# Altium project Ultrascale.PrjPcb (part 9 of 9)
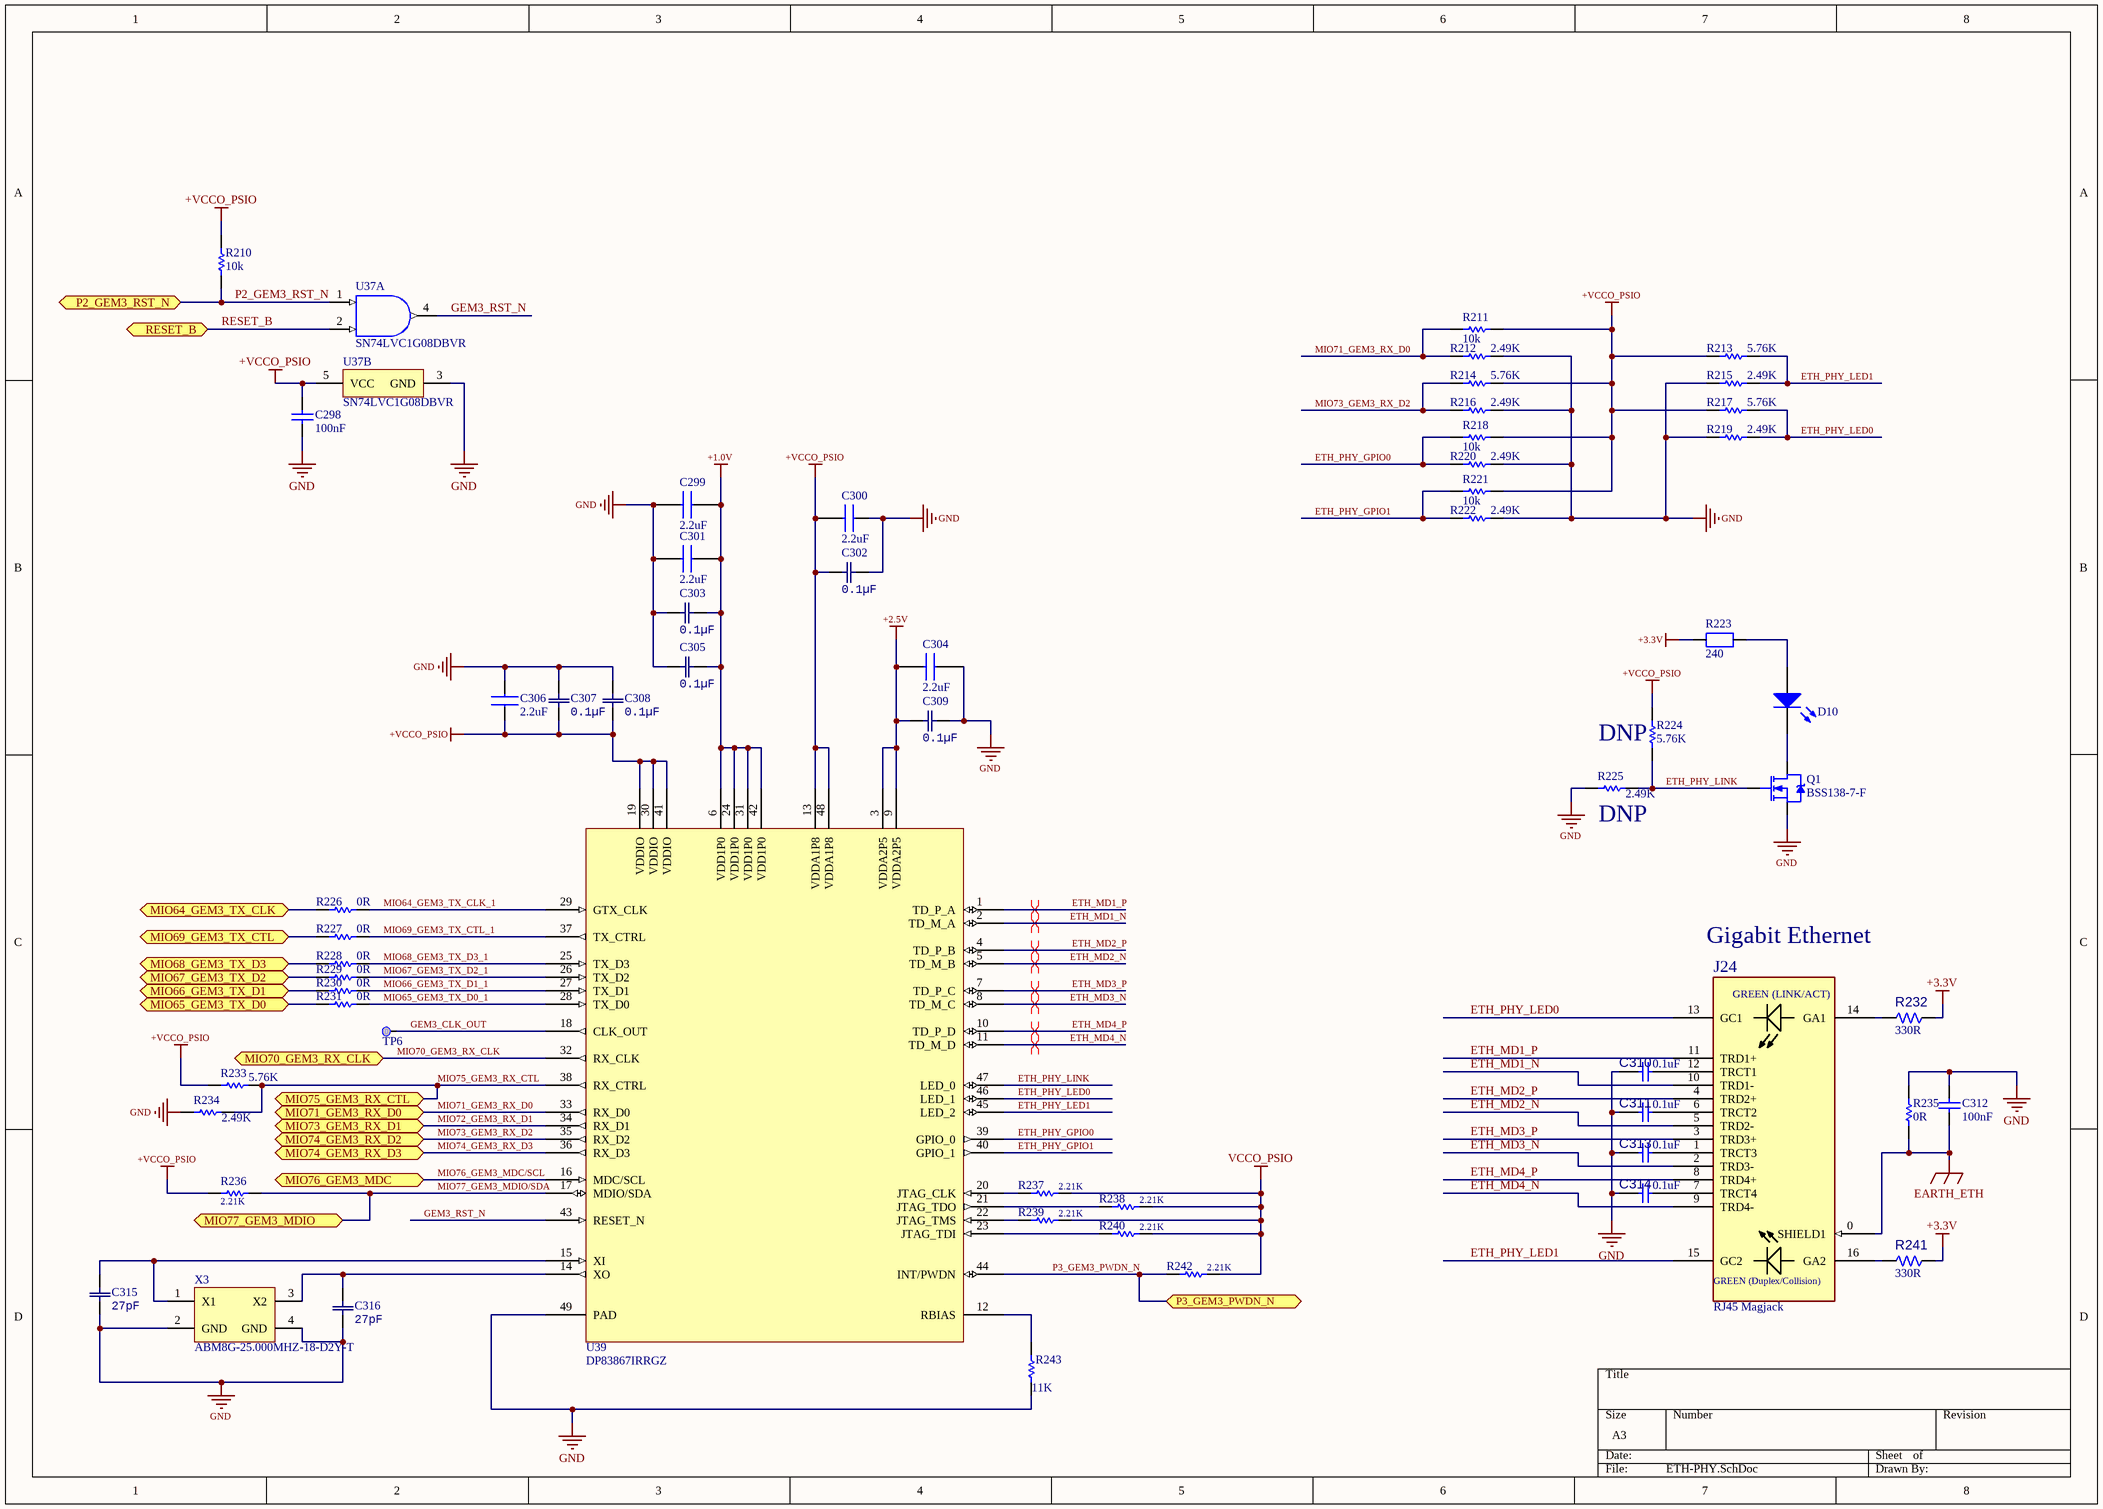
[diagram p24: ETH-PHY.SchDoc]

## Nets that join several sheets
2V5_ETH: Power3 (C414.2 R295.2 U48.9 U48.10), Eth_Switch (FB18.1 FB19.1 R170.2)
+3.3V: Power1 (16 pins), Power2 (16 pins), Power3 (35 pins), Power4 (8 pins), DDR4_SODIMM_PWR (20 pins), Zynq_Power (16 pins), QSPI_EMMC_MICROSD (8 pins), JTAG (9 pins), SYSMON (C96.1 U10.1), DisplayPort (12 pins), USB3.0_UART (16 pins), PMOD_ARD_RASP (16 pins), eMMC_TPM (30 pins), Eth_Switch (24 pins), Eth_Switch_RJ45 (10 pins), WIFI_BT (C280.1 C281.1 J21.1), ETH-PHY (R223.1 R232.2 R241.2)
+5.0V: Power3 (C396.1 C398.2 FB34.2 FB35.2), DisplayPort (C285.2 U35.1 U35.3), USB3.0_UART (C122.2 U21.7)
+MGTRAVCC: Power4 (C421.2 FB39.2 FB40.2 FB41.2), Zynq_Power (6 pins)
+MGTRAVTT: Power3 (C393.2 R281.2 U45.9 U45.10), Zynq_Power (C75.1 C76.2 FB2.1)
+VCC_PSINTFP: Power2 (6 pins), Zynq_Power (33 pins)
+VCC_PSPLL: Power3 (C407.2 R288.2 U47.9 U47.10), Zynq_Power (5 pins)
+VCCAUX: Power3 (5 pins), Zynq_Power (32 pins), QSPI_EMMC_MICROSD (40 pins), JTAG (22 pins), SYSMON (FB5.2 R28.1 R33.1 R34.1), PS_GTR (FB42.1), PL_IO (C1.2 R2.2 R3.2 U2.1), USB3.0_UART (11 pins), WIFI_BT (C277.2 FB21.1), ETH-PHY (22 pins)
+VCCINT: Power2 (C363.2 FB28.2 FB29.2 FB30.2), Zynq_Power (28 pins), SYSMON (R30.1)
+VCCO_HP_64: Power1 (C353.2 FB25.2 FB26.2 FB27.2), DDR4_SODIMM_PWR (C188.2 C189.2 R124.2 U28.2), Zynq_Power (15 pins), PL_DDR4_SODIMM (39 pins), PL_DDR4 (R245.2)
DDR4_DIMM_VDDQ: Power1 (C343.2 FB22.2 FB23.2 FB24.2), DDR4_SODIMM_PWR (C174.2 C175.2 R117.2 U26.2), Zynq_Power (13 pins), PS_DDR4_SODIMM (39 pins)
DDR4_VDDSPD_2V5: DDR4_SODIMM_PWR (C182.2 FB15.2), PS_DDR4_SODIMM (C157.2 J14.255 R112.2), PL_DDR4_SODIMM (C326.2 J25.255), PL_IO (5 pins)
EARTH_ETH: Eth_Switch_RJ45 (6 pins), ETH-PHY (C312.2 J24.0 R235.1)
GND: Power1 (36 pins), Power2 (38 pins), Power3 (64 pins), Power4 (18 pins), DDR4_SODIMM_PWR (42 pins), Zynq_Power (209 pins), QSPI_EMMC_MICROSD (50 pins), JTAG (39 pins), SYSMON (10 pins), PS_DDR4_SODIMM (117 pins), PL_DDR4_SODIMM (118 pins), PS_DDR4 (R131.1), PL_DDR4 (C317.1 C318.1 C319.1 R246.2), PS_GTR (15 pins), DisplayPort (31 pins), PL_IO (C1.1 C2.2 C3.1 U2.4), USB3.0_UART (41 pins), PMOD_ARD_RASP (40 pins), eMMC_TPM (83 pins), Eth_Switch (81 pins), Eth_Switch_RJ45 (21 pins), WIFI_BT (76 pins), ETH-PHY (34 pins)
GND_SYSMON: Zynq_Power (U1.W20), SYSMON (10 pins)
PL_DDR4_VPP_2V5: DDR4_SODIMM_PWR (C187.2 R128.2 U29.9 U29.10), PL_DDR4_SODIMM (J25.257 J25.259)
PL_DDR4_VTT: DDR4_SODIMM_PWR (5 pins), PL_DDR4_SODIMM (J25.258), PL_DDR4 (6 pins)
PS_DDR4_VPP_2V5: DDR4_SODIMM_PWR (6 pins), PS_DDR4_SODIMM (J14.257 J14.259)
PS_DDR4_VTT: DDR4_SODIMM_PWR (5 pins), PS_DDR4_SODIMM (J14.258)
PVIN_5V: Power3 (19 pins), PMOD_ARD_RASP (C137.2 FB12.1 FB14.1)
3.3V_PGOOD: Power2 (U42.38), Power3 (R283.1 R297.1 U44.8)
BT_EN_SOC: PL_IO (U1.AB10), WIFI_BT (R184.2 U34.41)
BT_HCI_CTS: PL_IO (U1.Y9), WIFI_BT (U34.51)
BT_HCI_RTS: PL_IO (U1.AA8), WIFI_BT (U34.50)
BT_HCI_RX: PL_IO (U1.W10), WIFI_BT (U34.53)
BT_HCI_TX: PL_IO (U1.Y10), WIFI_BT (U34.52)
CC_SCL: QSPI_EMMC_MICROSD (U14.6), PS_GTR (R309.1)
CC_SDA: QSPI_EMMC_MICROSD (U14.5), PS_GTR (R305.1)
DDR4_SODIMM_A0: PS_DDR4_SODIMM (J14.144), PS_DDR4 (U1.W28)
DDR4_SODIMM_A1: PS_DDR4_SODIMM (J14.133), PS_DDR4 (U1.Y28)
DDR4_SODIMM_A2: PS_DDR4_SODIMM (J14.132), PS_DDR4 (U1.AB28)
DDR4_SODIMM_A3: PS_DDR4_SODIMM (J14.131), PS_DDR4 (U1.AA28)
DDR4_SODIMM_A4: PS_DDR4_SODIMM (J14.128), PS_DDR4 (U1.Y27)
DDR4_SODIMM_A5: PS_DDR4_SODIMM (J14.126), PS_DDR4 (U1.AA27)
DDR4_SODIMM_A6: PS_DDR4_SODIMM (J14.127), PS_DDR4 (U1.Y22)
DDR4_SODIMM_A7: PS_DDR4_SODIMM (J14.122), PS_DDR4 (U1.AA23)
DDR4_SODIMM_A8: PS_DDR4_SODIMM (J14.125), PS_DDR4 (U1.AA22)
DDR4_SODIMM_A9: PS_DDR4_SODIMM (J14.121), PS_DDR4 (U1.AB23)
DDR4_SODIMM_A10: PS_DDR4_SODIMM (J14.146), PS_DDR4 (U1.AA25)
DDR4_SODIMM_A11: PS_DDR4_SODIMM (J14.120), PS_DDR4 (U1.AA26)
DDR4_SODIMM_A12: PS_DDR4_SODIMM (J14.119), PS_DDR4 (U1.AB25)
DDR4_SODIMM_A13: PS_DDR4_SODIMM (J14.158), PS_DDR4 (U1.AB26)
DDR4_SODIMM_ACT_B: PS_DDR4_SODIMM (J14.114), PS_DDR4 (U1.Y23)
DDR4_SODIMM_ALERT_B: PS_DDR4_SODIMM (J14.116), PS_DDR4 (U1.U25)
DDR4_SODIMM_BA0: PS_DDR4_SODIMM (J14.150), PS_DDR4 (U1.V23)
DDR4_SODIMM_BA1: PS_DDR4_SODIMM (J14.145), PS_DDR4 (U1.W22)
DDR4_SODIMM_BG0: PS_DDR4_SODIMM (J14.115), PS_DDR4 (U1.W24)
DDR4_SODIMM_BG1: PS_DDR4_SODIMM (J14.113), PS_DDR4 (U1.V22)
DDR4_SODIMM_CAS_B: PS_DDR4_SODIMM (J14.156), PS_DDR4 (U1.AC24)
DDR4_SODIMM_CB0: PS_DDR4_SODIMM (J14.92), PS_DDR4 (U1.T28)
DDR4_SODIMM_CB1: PS_DDR4_SODIMM (J14.91), PS_DDR4 (U1.R28)
DDR4_SODIMM_CB2: PS_DDR4_SODIMM (J14.101), PS_DDR4 (U1.P28)
DDR4_SODIMM_CB3: PS_DDR4_SODIMM (J14.105), PS_DDR4 (U1.P27)
DDR4_SODIMM_CB4: PS_DDR4_SODIMM (J14.88), PS_DDR4 (U1.P26)
DDR4_SODIMM_CB5: PS_DDR4_SODIMM (J14.87), PS_DDR4 (U1.R25)
DDR4_SODIMM_CB6: PS_DDR4_SODIMM (J14.100), PS_DDR4 (U1.P25)
DDR4_SODIMM_CB7: PS_DDR4_SODIMM (J14.104), PS_DDR4 (U1.T25)
DDR4_SODIMM_CK0_C: PS_DDR4_SODIMM (J14.139), PS_DDR4 (U1.W26)
DDR4_SODIMM_CK0_T: PS_DDR4_SODIMM (J14.137), PS_DDR4 (U1.W25)
DDR4_SODIMM_CK1_C: PS_DDR4_SODIMM (J14.140), PS_DDR4 (U1.Y25)
DDR4_SODIMM_CK1_T: PS_DDR4_SODIMM (J14.138), PS_DDR4 (U1.Y24)
DDR4_SODIMM_CKE0: PS_DDR4_SODIMM (J14.109 R108.1), PS_DDR4 (U1.V28)
DDR4_SODIMM_CKE1: PS_DDR4_SODIMM (J14.110 R109.1), PS_DDR4 (U1.V27)
DDR4_SODIMM_CS0_B: PS_DDR4_SODIMM (J14.149), PS_DDR4 (U1.W27)
DDR4_SODIMM_CS1_B: PS_DDR4_SODIMM (J14.157), PS_DDR4 (U1.V26)
DDR4_SODIMM_DM0_B: PS_DDR4_SODIMM (J14.12), PS_DDR4 (U1.AG20)
DDR4_SODIMM_DM1_B: PS_DDR4_SODIMM (J14.33), PS_DDR4 (U1.AE23)
DDR4_SODIMM_DM2_B: PS_DDR4_SODIMM (J14.54), PS_DDR4 (U1.AE25)
DDR4_SODIMM_DM3_B: PS_DDR4_SODIMM (J14.75), PS_DDR4 (U1.AE28)
DDR4_SODIMM_DM4_B: PS_DDR4_SODIMM (J14.178), PS_DDR4 (U1.R23)
DDR4_SODIMM_DM5_B: PS_DDR4_SODIMM (J14.199), PS_DDR4 (U1.H23)
DDR4_SODIMM_DM6_B: PS_DDR4_SODIMM (J14.220), PS_DDR4 (U1.L27)
DDR4_SODIMM_DM7_B: PS_DDR4_SODIMM (J14.241), PS_DDR4 (U1.H26)
DDR4_SODIMM_DM8_B: PS_DDR4_SODIMM (J14.96), PS_DDR4 (U1.T26)
DDR4_SODIMM_DQ0: PS_DDR4_SODIMM (J14.8), PS_DDR4 (U1.AD21)
DDR4_SODIMM_DQ1: PS_DDR4_SODIMM (J14.7), PS_DDR4 (U1.AE20)
DDR4_SODIMM_DQ2: PS_DDR4_SODIMM (J14.20), PS_DDR4 (U1.AD20)
DDR4_SODIMM_DQ3: PS_DDR4_SODIMM (J14.21), PS_DDR4 (U1.AF20)
DDR4_SODIMM_DQ4: PS_DDR4_SODIMM (J14.4), PS_DDR4 (U1.AH21)
DDR4_SODIMM_DQ5: PS_DDR4_SODIMM (J14.3), PS_DDR4 (U1.AH20)
DDR4_SODIMM_DQ6: PS_DDR4_SODIMM (J14.16), PS_DDR4 (U1.AH19)
DDR4_SODIMM_DQ7: PS_DDR4_SODIMM (J14.17), PS_DDR4 (U1.AG19)
DDR4_SODIMM_DQ8: PS_DDR4_SODIMM (J14.28), PS_DDR4 (U1.AF22)
DDR4_SODIMM_DQ9: PS_DDR4_SODIMM (J14.29), PS_DDR4 (U1.AH22)
DDR4_SODIMM_DQ10: PS_DDR4_SODIMM (J14.41), PS_DDR4 (U1.AE22)
DDR4_SODIMM_DQ11: PS_DDR4_SODIMM (J14.42), PS_DDR4 (U1.AD22)
DDR4_SODIMM_DQ12: PS_DDR4_SODIMM (J14.24), PS_DDR4 (U1.AH23)
DDR4_SODIMM_DQ13: PS_DDR4_SODIMM (J14.25), PS_DDR4 (U1.AH24)
DDR4_SODIMM_DQ14: PS_DDR4_SODIMM (J14.38), PS_DDR4 (U1.AE24)
DDR4_SODIMM_DQ15: PS_DDR4_SODIMM (J14.37), PS_DDR4 (U1.AG24)
DDR4_SODIMM_DQ16: PS_DDR4_SODIMM (J14.50), PS_DDR4 (U1.AC26)
DDR4_SODIMM_DQ17: PS_DDR4_SODIMM (J14.49), PS_DDR4 (U1.AD26)
DDR4_SODIMM_DQ18: PS_DDR4_SODIMM (J14.62), PS_DDR4 (U1.AD25)
DDR4_SODIMM_DQ19: PS_DDR4_SODIMM (J14.63), PS_DDR4 (U1.AD24)
DDR4_SODIMM_DQ20: PS_DDR4_SODIMM (J14.46), PS_DDR4 (U1.AG26)
DDR4_SODIMM_DQ21: PS_DDR4_SODIMM (J14.45), PS_DDR4 (U1.AH25)
DDR4_SODIMM_DQ22: PS_DDR4_SODIMM (J14.58), PS_DDR4 (U1.AH26)
DDR4_SODIMM_DQ23: PS_DDR4_SODIMM (J14.59), PS_DDR4 (U1.AG25)
DDR4_SODIMM_DQ24: PS_DDR4_SODIMM (J14.70), PS_DDR4 (U1.AH27)
DDR4_SODIMM_DQ25: PS_DDR4_SODIMM (J14.71), PS_DDR4 (U1.AH28)
DDR4_SODIMM_DQ26: PS_DDR4_SODIMM (J14.83), PS_DDR4 (U1.AF28)
DDR4_SODIMM_DQ27: PS_DDR4_SODIMM (J14.84), PS_DDR4 (U1.AG28)
DDR4_SODIMM_DQ28: PS_DDR4_SODIMM (J14.66), PS_DDR4 (U1.AC27)
DDR4_SODIMM_DQ29: PS_DDR4_SODIMM (J14.67), PS_DDR4 (U1.AD27)
DDR4_SODIMM_DQ30: PS_DDR4_SODIMM (J14.79), PS_DDR4 (U1.AD28)
DDR4_SODIMM_DQ31: PS_DDR4_SODIMM (J14.80), PS_DDR4 (U1.AC28)
DDR4_SODIMM_DQ32: PS_DDR4_SODIMM (J14.174), PS_DDR4 (U1.T22)
DDR4_SODIMM_DQ33: PS_DDR4_SODIMM (J14.173), PS_DDR4 (U1.R22)
DDR4_SODIMM_DQ34: PS_DDR4_SODIMM (J14.187), PS_DDR4 (U1.P22)
DDR4_SODIMM_DQ35: PS_DDR4_SODIMM (J14.186), PS_DDR4 (U1.N22)
DDR4_SODIMM_DQ36: PS_DDR4_SODIMM (J14.170), PS_DDR4 (U1.T23)
DDR4_SODIMM_DQ37: PS_DDR4_SODIMM (J14.169), PS_DDR4 (U1.P24)
DDR4_SODIMM_DQ38: PS_DDR4_SODIMM (J14.183), PS_DDR4 (U1.R24)
DDR4_SODIMM_DQ39: PS_DDR4_SODIMM (J14.182), PS_DDR4 (U1.N24)
DDR4_SODIMM_DQ40: PS_DDR4_SODIMM (J14.195), PS_DDR4 (U1.H24)
DDR4_SODIMM_DQ41: PS_DDR4_SODIMM (J14.194), PS_DDR4 (U1.J24)
DDR4_SODIMM_DQ42: PS_DDR4_SODIMM (J14.207), PS_DDR4 (U1.M24)
DDR4_SODIMM_DQ43: PS_DDR4_SODIMM (J14.208), PS_DDR4 (U1.K24)
DDR4_SODIMM_DQ44: PS_DDR4_SODIMM (J14.191), PS_DDR4 (U1.J22)
DDR4_SODIMM_DQ45: PS_DDR4_SODIMM (J14.190), PS_DDR4 (U1.H22)
DDR4_SODIMM_DQ46: PS_DDR4_SODIMM (J14.203), PS_DDR4 (U1.K22)
DDR4_SODIMM_DQ47: PS_DDR4_SODIMM (J14.204), PS_DDR4 (U1.L22)
DDR4_SODIMM_DQ48: PS_DDR4_SODIMM (J14.216), PS_DDR4 (U1.M25)
DDR4_SODIMM_DQ49: PS_DDR4_SODIMM (J14.215), PS_DDR4 (U1.M26)
DDR4_SODIMM_DQ50: PS_DDR4_SODIMM (J14.228), PS_DDR4 (U1.L25)
DDR4_SODIMM_DQ51: PS_DDR4_SODIMM (J14.229), PS_DDR4 (U1.L26)
DDR4_SODIMM_DQ52: PS_DDR4_SODIMM (J14.211), PS_DDR4 (U1.K28)
DDR4_SODIMM_DQ53: PS_DDR4_SODIMM (J14.212), PS_DDR4 (U1.L28)
DDR4_SODIMM_DQ54: PS_DDR4_SODIMM (J14.224), PS_DDR4 (U1.M28)
DDR4_SODIMM_DQ55: PS_DDR4_SODIMM (J14.225), PS_DDR4 (U1.N28)
DDR4_SODIMM_DQ56: PS_DDR4_SODIMM (J14.237), PS_DDR4 (U1.J28)
DDR4_SODIMM_DQ57: PS_DDR4_SODIMM (J14.236), PS_DDR4 (U1.K27)
DDR4_SODIMM_DQ58: PS_DDR4_SODIMM (J14.249), PS_DDR4 (U1.H28)
DDR4_SODIMM_DQ59: PS_DDR4_SODIMM (J14.250), PS_DDR4 (U1.H27)
DDR4_SODIMM_DQ60: PS_DDR4_SODIMM (J14.232), PS_DDR4 (U1.G26)
DDR4_SODIMM_DQ61: PS_DDR4_SODIMM (J14.233), PS_DDR4 (U1.G25)
DDR4_SODIMM_DQ62: PS_DDR4_SODIMM (J14.245), PS_DDR4 (U1.K25)
DDR4_SODIMM_DQ63: PS_DDR4_SODIMM (J14.246), PS_DDR4 (U1.J25)
DDR4_SODIMM_DQS0_C: PS_DDR4_SODIMM (J14.11), PS_DDR4 (U1.AG21)
DDR4_SODIMM_DQS0_T: PS_DDR4_SODIMM (J14.13), PS_DDR4 (U1.AF21)
DDR4_SODIMM_DQS1_C: PS_DDR4_SODIMM (J14.32), PS_DDR4 (U1.AG23)
DDR4_SODIMM_DQS1_T: PS_DDR4_SODIMM (J14.34), PS_DDR4 (U1.AF23)
DDR4_SODIMM_DQS2_C: PS_DDR4_SODIMM (J14.53), PS_DDR4 (U1.AF26)
DDR4_SODIMM_DQS2_T: PS_DDR4_SODIMM (J14.55), PS_DDR4 (U1.AF25)
DDR4_SODIMM_DQS3_C: PS_DDR4_SODIMM (J14.74), PS_DDR4 (U1.AF27)
DDR4_SODIMM_DQS3_T: PS_DDR4_SODIMM (J14.76), PS_DDR4 (U1.AE27)
DDR4_SODIMM_DQS4_C: PS_DDR4_SODIMM (J14.177), PS_DDR4 (U1.M23)
DDR4_SODIMM_DQS4_T: PS_DDR4_SODIMM (J14.179), PS_DDR4 (U1.N23)
DDR4_SODIMM_DQS5_C: PS_DDR4_SODIMM (J14.198), PS_DDR4 (U1.K23)
DDR4_SODIMM_DQS5_T: PS_DDR4_SODIMM (J14.200), PS_DDR4 (U1.L23)
DDR4_SODIMM_DQS6_C: PS_DDR4_SODIMM (J14.219), PS_DDR4 (U1.N27)
DDR4_SODIMM_DQS6_T: PS_DDR4_SODIMM (J14.221), PS_DDR4 (U1.N26)
DDR4_SODIMM_DQS7_C: PS_DDR4_SODIMM (J14.240), PS_DDR4 (U1.J27)
DDR4_SODIMM_DQS7_T: PS_DDR4_SODIMM (J14.242), PS_DDR4 (U1.J26)
DDR4_SODIMM_DQS8_C: PS_DDR4_SODIMM (J14.95), PS_DDR4 (U1.T27)
DDR4_SODIMM_DQS8_T: PS_DDR4_SODIMM (J14.97), PS_DDR4 (U1.R27)
DDR4_SODIMM_ODT0: PS_DDR4_SODIMM (J14.155), PS_DDR4 (U1.U28)
DDR4_SODIMM_ODT1: PS_DDR4_SODIMM (J14.161), PS_DDR4 (U1.U26)
DDR4_SODIMM_PARITY: PS_DDR4_SODIMM (J14.143), PS_DDR4 (U1.V24)
DDR4_SODIMM_PL_A0: PL_DDR4_SODIMM (J25.144), PL_DDR4 (U1.AB8)
DDR4_SODIMM_PL_A1: PL_DDR4_SODIMM (J25.133), PL_DDR4 (U1.AC8)
DDR4_SODIMM_PL_A2: PL_DDR4_SODIMM (J25.132), PL_DDR4 (U1.AD7)
DDR4_SODIMM_PL_A3: PL_DDR4_SODIMM (J25.131), PL_DDR4 (U1.AE7)
DDR4_SODIMM_PL_A4: PL_DDR4_SODIMM (J25.128), PL_DDR4 (U1.AB7)
DDR4_SODIMM_PL_A5: PL_DDR4_SODIMM (J25.126), PL_DDR4 (U1.AC7)
DDR4_SODIMM_PL_A6: PL_DDR4_SODIMM (J25.127), PL_DDR4 (U1.AB6)
DDR4_SODIMM_PL_A7: PL_DDR4_SODIMM (J25.122), PL_DDR4 (U1.AC6)
DDR4_SODIMM_PL_A8: PL_DDR4_SODIMM (J25.125), PL_DDR4 (U1.AG9)
DDR4_SODIMM_PL_A9: PL_DDR4_SODIMM (J25.121), PL_DDR4 (U1.AH9)
DDR4_SODIMM_PL_A10: PL_DDR4_SODIMM (J25.146), PL_DDR4 (U1.AF8)
DDR4_SODIMM_PL_A11: PL_DDR4_SODIMM (J25.120), PL_DDR4 (U1.AG8)
DDR4_SODIMM_PL_A12: PL_DDR4_SODIMM (J25.119), PL_DDR4 (U1.AH8)
DDR4_SODIMM_PL_A13: PL_DDR4_SODIMM (J25.158), PL_DDR4 (U1.AH7)
DDR4_SODIMM_PL_ACT_B: PL_DDR4_SODIMM (J25.114), PL_DDR4 (U1.AB2)
DDR4_SODIMM_PL_ALERT_B: PL_DDR4_SODIMM (J25.116), PL_DDR4 (R244.2 R245.1)
DDR4_SODIMM_PL_BA0: PL_DDR4_SODIMM (J25.150), PL_DDR4 (U1.AF5)
DDR4_SODIMM_PL_BA1: PL_DDR4_SODIMM (J25.145), PL_DDR4 (U1.AH6)
DDR4_SODIMM_PL_BG0: PL_DDR4_SODIMM (J25.115), PL_DDR4 (U1.AD5)
DDR4_SODIMM_PL_BG1: PL_DDR4_SODIMM (J25.113), PL_DDR4 (U1.AD4)
DDR4_SODIMM_PL_CAS_B: PL_DDR4_SODIMM (J25.156), PL_DDR4 (U1.AG5)
DDR4_SODIMM_PL_CB0: PL_DDR4_SODIMM (J25.92), PL_DDR4 (U1.C6)
DDR4_SODIMM_PL_CB1: PL_DDR4_SODIMM (J25.91), PL_DDR4 (U1.B6)
DDR4_SODIMM_PL_CB2: PL_DDR4_SODIMM (J25.101), PL_DDR4 (U1.A7)
DDR4_SODIMM_PL_CB3: PL_DDR4_SODIMM (J25.105), PL_DDR4 (U1.A6)
DDR4_SODIMM_PL_CB4: PL_DDR4_SODIMM (J25.88), PL_DDR4 (U1.A9)
DDR4_SODIMM_PL_CB5: PL_DDR4_SODIMM (J25.87), PL_DDR4 (U1.A8)
DDR4_SODIMM_PL_CB6: PL_DDR4_SODIMM (J25.100), PL_DDR4 (U1.C9)
DDR4_SODIMM_PL_CB7: PL_DDR4_SODIMM (J25.104), PL_DDR4 (U1.B9)
DDR4_SODIMM_PL_CK0_C: PL_DDR4_SODIMM (J25.139), PL_DDR4 (U1.AD9)
DDR4_SODIMM_PL_CK0_T: PL_DDR4_SODIMM (J25.137), PL_DDR4 (U1.AC9)
DDR4_SODIMM_PL_CK1_C: PL_DDR4_SODIMM (J25.140), PL_DDR4 (U1.AE8)
DDR4_SODIMM_PL_CK1_T: PL_DDR4_SODIMM (J25.138), PL_DDR4 (U1.AE9)
DDR4_SODIMM_PL_CKE0: PL_DDR4_SODIMM (J25.109 R248.1), PL_DDR4 (U1.AB4)
DDR4_SODIMM_PL_CKE1: PL_DDR4_SODIMM (J25.110 R249.1), PL_DDR4 (U1.AB3)
DDR4_SODIMM_PL_CS0_B: PL_DDR4_SODIMM (J25.149), PL_DDR4 (U1.AC4)
DDR4_SODIMM_PL_CS1_B: PL_DDR4_SODIMM (J25.157), PL_DDR4 (U1.AC3)
DDR4_SODIMM_PL_DM0_B: PL_DDR4_SODIMM (J25.12), PL_DDR4 (U1.AG4)
DDR4_SODIMM_PL_DM1_B: PL_DDR4_SODIMM (J25.33), PL_DDR4 (U1.W8)
DDR4_SODIMM_PL_DM2_B: PL_DDR4_SODIMM (J25.54), PL_DDR4 (U1.L1)
DDR4_SODIMM_PL_DM3_B: PL_DDR4_SODIMM (J25.75), PL_DDR4 (U1.L7)
DDR4_SODIMM_PL_DM4_B: PL_DDR4_SODIMM (J25.178), PL_DDR4 (U1.J5)
DDR4_SODIMM_PL_DM5_B: PL_DDR4_SODIMM (J25.199), PL_DDR4 (U1.G1)
DDR4_SODIMM_PL_DM6_B: PL_DDR4_SODIMM (J25.220), PL_DDR4 (U1.C1)
DDR4_SODIMM_PL_DM7_B: PL_DDR4_SODIMM (J25.241), PL_DDR4 (U1.D7)
DDR4_SODIMM_PL_DM8_B: PL_DDR4_SODIMM (J25.96), PL_DDR4 (U1.B5)
DDR4_SODIMM_PL_DQ0: PL_DDR4_SODIMM (J25.8), PL_DDR4 (U1.AG3)
DDR4_SODIMM_PL_DQ1: PL_DDR4_SODIMM (J25.7), PL_DDR4 (U1.AH3)
DDR4_SODIMM_PL_DQ2: PL_DDR4_SODIMM (J25.20), PL_DDR4 (U1.AE3)
DDR4_SODIMM_PL_DQ3: PL_DDR4_SODIMM (J25.21), PL_DDR4 (U1.AF3)
DDR4_SODIMM_PL_DQ4: PL_DDR4_SODIMM (J25.4), PL_DDR4 (U1.AH2)
DDR4_SODIMM_PL_DQ5: PL_DDR4_SODIMM (J25.3), PL_DDR4 (U1.AH1)
DDR4_SODIMM_PL_DQ6: PL_DDR4_SODIMM (J25.16), PL_DDR4 (U1.AF1)
DDR4_SODIMM_PL_DQ7: PL_DDR4_SODIMM (J25.17), PL_DDR4 (U1.AG1)
DDR4_SODIMM_PL_DQ8: PL_DDR4_SODIMM (J25.28), PL_DDR4 (U1.U9)
DDR4_SODIMM_PL_DQ9: PL_DDR4_SODIMM (J25.29), PL_DDR4 (U1.V9)
DDR4_SODIMM_PL_DQ10: PL_DDR4_SODIMM (J25.41), PL_DDR4 (U1.U8)
DDR4_SODIMM_PL_DQ11: PL_DDR4_SODIMM (J25.42), PL_DDR4 (U1.V8)
DDR4_SODIMM_PL_DQ12: PL_DDR4_SODIMM (J25.24), PL_DDR4 (U1.R7)
DDR4_SODIMM_PL_DQ13: PL_DDR4_SODIMM (J25.25), PL_DDR4 (U1.T7)
DDR4_SODIMM_PL_DQ14: PL_DDR4_SODIMM (J25.38), PL_DDR4 (U1.R6)
DDR4_SODIMM_PL_DQ15: PL_DDR4_SODIMM (J25.37), PL_DDR4 (U1.T6)
DDR4_SODIMM_PL_DQ16: PL_DDR4_SODIMM (J25.50), PL_DDR4 (U1.J1)
DDR4_SODIMM_PL_DQ17: PL_DDR4_SODIMM (J25.49), PL_DDR4 (U1.H1)
DDR4_SODIMM_PL_DQ18: PL_DDR4_SODIMM (J25.62), PL_DDR4 (U1.K2)
DDR4_SODIMM_PL_DQ19: PL_DDR4_SODIMM (J25.63), PL_DDR4 (U1.J2)
DDR4_SODIMM_PL_DQ20: PL_DDR4_SODIMM (J25.46), PL_DDR4 (U1.K4)
DDR4_SODIMM_PL_DQ21: PL_DDR4_SODIMM (J25.45), PL_DDR4 (U1.K3)
DDR4_SODIMM_PL_DQ22: PL_DDR4_SODIMM (J25.58), PL_DDR4 (U1.L3)
DDR4_SODIMM_PL_DQ23: PL_DDR4_SODIMM (J25.59), PL_DDR4 (U1.L2)
DDR4_SODIMM_PL_DQ24: PL_DDR4_SODIMM (J25.70), PL_DDR4 (U1.M6)
DDR4_SODIMM_PL_DQ25: PL_DDR4_SODIMM (J25.71), PL_DDR4 (U1.L5)
DDR4_SODIMM_PL_DQ26: PL_DDR4_SODIMM (J25.83), PL_DDR4 (U1.N7)
DDR4_SODIMM_PL_DQ27: PL_DDR4_SODIMM (J25.84), PL_DDR4 (U1.N6)
DDR4_SODIMM_PL_DQ28: PL_DDR4_SODIMM (J25.66), PL_DDR4 (U1.N9)
DDR4_SODIMM_PL_DQ29: PL_DDR4_SODIMM (J25.67), PL_DDR4 (U1.N8)
DDR4_SODIMM_PL_DQ30: PL_DDR4_SODIMM (J25.79), PL_DDR4 (U1.M8)
DDR4_SODIMM_PL_DQ31: PL_DDR4_SODIMM (J25.80), PL_DDR4 (U1.L8)
DDR4_SODIMM_PL_DQ32: PL_DDR4_SODIMM (J25.174), PL_DDR4 (U1.J6)
DDR4_SODIMM_PL_DQ33: PL_DDR4_SODIMM (J25.173), PL_DDR4 (U1.H6)
DDR4_SODIMM_PL_DQ34: PL_DDR4_SODIMM (J25.187), PL_DDR4 (U1.J7)
DDR4_SODIMM_PL_DQ35: PL_DDR4_SODIMM (J25.186), PL_DDR4 (U1.H7)
DDR4_SODIMM_PL_DQ36: PL_DDR4_SODIMM (J25.170), PL_DDR4 (U1.K9)
DDR4_SODIMM_PL_DQ37: PL_DDR4_SODIMM (J25.169), PL_DDR4 (U1.J9)
DDR4_SODIMM_PL_DQ38: PL_DDR4_SODIMM (J25.183), PL_DDR4 (U1.H9)
DDR4_SODIMM_PL_DQ39: PL_DDR4_SODIMM (J25.182), PL_DDR4 (U1.H8)
DDR4_SODIMM_PL_DQ40: PL_DDR4_SODIMM (J25.195), PL_DDR4 (U1.E1)
DDR4_SODIMM_PL_DQ41: PL_DDR4_SODIMM (J25.194), PL_DDR4 (U1.D1)
DDR4_SODIMM_PL_DQ42: PL_DDR4_SODIMM (J25.207), PL_DDR4 (U1.F2)
DDR4_SODIMM_PL_DQ43: PL_DDR4_SODIMM (J25.208), PL_DDR4 (U1.E2)
DDR4_SODIMM_PL_DQ44: PL_DDR4_SODIMM (J25.191), PL_DDR4 (U1.E4)
DDR4_SODIMM_PL_DQ45: PL_DDR4_SODIMM (J25.190), PL_DDR4 (U1.E3)
DDR4_SODIMM_PL_DQ46: PL_DDR4_SODIMM (J25.203), PL_DDR4 (U1.G5)
DDR4_SODIMM_PL_DQ47: PL_DDR4_SODIMM (J25.204), PL_DDR4 (U1.F5)
DDR4_SODIMM_PL_DQ48: PL_DDR4_SODIMM (J25.216), PL_DDR4 (U1.A2)
DDR4_SODIMM_PL_DQ49: PL_DDR4_SODIMM (J25.215), PL_DDR4 (U1.A1)
DDR4_SODIMM_PL_DQ50: PL_DDR4_SODIMM (J25.228), PL_DDR4 (U1.B3)
DDR4_SODIMM_PL_DQ51: PL_DDR4_SODIMM (J25.229), PL_DDR4 (U1.A3)
DDR4_SODIMM_PL_DQ52: PL_DDR4_SODIMM (J25.211), PL_DDR4 (U1.D4)
DDR4_SODIMM_PL_DQ53: PL_DDR4_SODIMM (J25.212), PL_DDR4 (U1.C4)
DDR4_SODIMM_PL_DQ54: PL_DDR4_SODIMM (J25.224), PL_DDR4 (U1.C3)
DDR4_SODIMM_PL_DQ55: PL_DDR4_SODIMM (J25.225), PL_DDR4 (U1.C2)
DDR4_SODIMM_PL_DQ56: PL_DDR4_SODIMM (J25.237), PL_DDR4 (U1.E5)
DDR4_SODIMM_PL_DQ57: PL_DDR4_SODIMM (J25.236), PL_DDR4 (U1.D5)
DDR4_SODIMM_PL_DQ58: PL_DDR4_SODIMM (J25.249), PL_DDR4 (U1.G6)
DDR4_SODIMM_PL_DQ59: PL_DDR4_SODIMM (J25.250), PL_DDR4 (U1.F6)
DDR4_SODIMM_PL_DQ60: PL_DDR4_SODIMM (J25.232), PL_DDR4 (U1.F8)
DDR4_SODIMM_PL_DQ61: PL_DDR4_SODIMM (J25.233), PL_DDR4 (U1.E8)
DDR4_SODIMM_PL_DQ62: PL_DDR4_SODIMM (J25.245), PL_DDR4 (U1.E9)
DDR4_SODIMM_PL_DQ63: PL_DDR4_SODIMM (J25.246), PL_DDR4 (U1.D9)
DDR4_SODIMM_PL_DQS0_C: PL_DDR4_SODIMM (J25.11), PL_DDR4 (U1.AF2)
DDR4_SODIMM_PL_DQS0_T: PL_DDR4_SODIMM (J25.13), PL_DDR4 (U1.AE2)
DDR4_SODIMM_PL_DQS1_C: PL_DDR4_SODIMM (J25.32), PL_DDR4 (U1.T8)
DDR4_SODIMM_PL_DQS1_T: PL_DDR4_SODIMM (J25.34), PL_DDR4 (U1.R8)
DDR4_SODIMM_PL_DQS2_C: PL_DDR4_SODIMM (J25.53), PL_DDR4 (U1.H3)
DDR4_SODIMM_PL_DQS2_T: PL_DDR4_SODIMM (J25.55), PL_DDR4 (U1.H4)
DDR4_SODIMM_PL_DQS3_C: PL_DDR4_SODIMM (J25.74), PL_DDR4 (U1.P6)
DDR4_SODIMM_PL_DQS3_T: PL_DDR4_SODIMM (J25.76), PL_DDR4 (U1.P7)
DDR4_SODIMM_PL_DQS4_C: PL_DDR4_SODIMM (J25.177), PL_DDR4 (U1.K7)
DDR4_SODIMM_PL_DQS4_T: PL_DDR4_SODIMM (J25.179), PL_DDR4 (U1.K8)
DDR4_SODIMM_PL_DQS5_C: PL_DDR4_SODIMM (J25.198), PL_DDR4 (U1.F3)
DDR4_SODIMM_PL_DQS5_T: PL_DDR4_SODIMM (J25.200), PL_DDR4 (U1.G3)
DDR4_SODIMM_PL_DQS6_C: PL_DDR4_SODIMM (J25.219), PL_DDR4 (U1.A4)
DDR4_SODIMM_PL_DQS6_T: PL_DDR4_SODIMM (J25.221), PL_DDR4 (U1.B4)
DDR4_SODIMM_PL_DQS7_C: PL_DDR4_SODIMM (J25.240), PL_DDR4 (U1.F7)
DDR4_SODIMM_PL_DQS7_T: PL_DDR4_SODIMM (J25.242), PL_DDR4 (U1.G8)
DDR4_SODIMM_PL_DQS8_C: PL_DDR4_SODIMM (J25.95), PL_DDR4 (U1.B8)
DDR4_SODIMM_PL_DQS8_T: PL_DDR4_SODIMM (J25.97), PL_DDR4 (U1.C8)
DDR4_SODIMM_PL_ODT0: PL_DDR4_SODIMM (J25.155), PL_DDR4 (U1.AD2)
DDR4_SODIMM_PL_ODT1: PL_DDR4_SODIMM (J25.161), PL_DDR4 (U1.AD1)
DDR4_SODIMM_PL_PARITY: PL_DDR4_SODIMM (J25.143), PL_DDR4 (R246.1)
DDR4_SODIMM_PL_RAS_B: PL_DDR4_SODIMM (J25.152), PL_DDR4 (U1.AE5)
DDR4_SODIMM_PL_RESET_B: PL_DDR4_SODIMM (J25.108), PL_DDR4 (U1.AC2)
DDR4_SODIMM_PL_SCL: PS_DDR4_SODIMM (J14.253), PL_DDR4_SODIMM (J25.253), PL_IO (R4.1 U2.7)
DDR4_SODIMM_PL_SDA: PS_DDR4_SODIMM (J14.254), PL_DDR4_SODIMM (J25.254), PL_IO (R5.1 U2.6)
DDR4_SODIMM_PL_WE_B: PL_DDR4_SODIMM (J25.151), PL_DDR4 (U1.AG6)
DDR4_SODIMM_RAS_B: PS_DDR4_SODIMM (J14.152), PS_DDR4 (U1.AC23)
DDR4_SODIMM_RESET_B: PS_DDR4_SODIMM (J14.108), PS_DDR4 (U1.U23)
DDR4_SODIMM_WE_B: PS_DDR4_SODIMM (J14.151), PS_DDR4 (U1.AB24)
DP_HPD: DisplayPort (R197.1), PL_IO (U1.E13)
DP_IN: DisplayPort (R208.1), PL_IO (U1.E14)
DP_OE: DisplayPort (R205.1), PL_IO (U1.F13)
DP_OUT: DisplayPort (R207.1), PL_IO (U1.G13)
ETH_MISO: PL_IO (U1.D14), Eth_Switch (R166.2 U31.97)
ETH_MOSI: PL_IO (U1.D15), Eth_Switch (R165.2 U31.98)
ETH_SCLK: PL_IO (U1.C14), Eth_Switch (U31.101)
ETH_SCS: PL_IO (U1.C13), Eth_Switch (R164.2 U31.100)
ETH_SW_RESETN: PL_IO (U1.A13), Eth_Switch (R160.1 U33.1)
GRXCK: PS_MIO (U1.J16), Eth_Switch (R150.2)
GRXCTL: PS_MIO (U1.J17), Eth_Switch (R151.2)
GRXD0: PS_MIO (U1.L16), Eth_Switch (R155.2 R159.1 R172.1)
GRXD1: PS_MIO (U1.L17), Eth_Switch (R154.2 R158.1)
GRXD2: PS_MIO (U1.H17), Eth_Switch (R153.2 R157.1)
GRXD3: PS_MIO (U1.K17), Eth_Switch (R152.2 R156.1)
GTR_RX0_N: PS_GTR (U1.F28), USB3.0_UART (J4.5 U23.2 U23.9)
GTR_RX0_P: PS_GTR (U1.F27), USB3.0_UART (J4.6 U23.1 U23.10)
GTR_TX0_N: PS_GTR (U1.E26), USB3.0_UART (C129.1)
GTR_TX0_P: PS_GTR (U1.E25), USB3.0_UART (C130.1)
GTR_TX2_N: PS_GTR (U1.C26), DisplayPort (C286.1)
GTR_TX2_P: PS_GTR (U1.C25), DisplayPort (C284.1)
GTR_TX3_N: PS_GTR (U1.B24), DisplayPort (C283.1)
GTR_TX3_P: PS_GTR (U1.B23), DisplayPort (C282.1)
GTXCK: PS_MIO (U1.L15), Eth_Switch (U31.48)
GTXCTL: PS_MIO (U1.H16), Eth_Switch (U31.49)
GTXD0: PS_MIO (U1.J15), Eth_Switch (U31.55)
GTXD1: PS_MIO (U1.K15), Eth_Switch (U31.54)
GTXD2: PS_MIO (U1.G16), Eth_Switch (U31.53)
GTXD3: PS_MIO (U1.F16), Eth_Switch (U31.52)
ID: PL_IO (U1.G15), eMMC_TPM (U30.14)
INTRP_N: PL_IO (U1.A14), Eth_Switch (R163.2 U31.94)
LAD0: PL_IO (U1.H13), eMMC_TPM (U30.11)
LAD1: PL_IO (U1.G14), eMMC_TPM (U30.10)
LAD2: PL_IO (U1.H14), eMMC_TPM (U30.8)
LAD3: PL_IO (U1.K14), eMMC_TPM (U30.7)
LCLK: PL_IO (U1.L13), eMMC_TPM (U30.1)
LED1_0: Eth_Switch (R175.1 U31.105), Eth_Switch_RJ45 (J16.13)
LED1_1: Eth_Switch (R176.1 U31.106), Eth_Switch_RJ45 (J16.15)
LED2_0: Eth_Switch (R173.1 U31.91), Eth_Switch_RJ45 (J17.13)
LED2_1: Eth_Switch (R177.1 U31.92), Eth_Switch_RJ45 (J17.15)
LED3_0: Eth_Switch (U31.88), Eth_Switch_RJ45 (J19.13)
LED3_1: Eth_Switch (U31.89), Eth_Switch_RJ45 (J19.15)
LED4_0: Eth_Switch (R174.1 U31.85), Eth_Switch_RJ45 (J15.13)
LED4_1: Eth_Switch (R178.1 U31.86), Eth_Switch_RJ45 (J15.15)
LED5_0: Eth_Switch (U31.102), Eth_Switch_RJ45 (J18.13)
LED5_1: Eth_Switch (R179.1 U31.103), Eth_Switch_RJ45 (J18.15)
LFRAME: PL_IO (U1.L14), eMMC_TPM (U30.3)
LRESET: PL_IO (U1.J14), eMMC_TPM (U30.5)
MGTRAVCC_GOOD: Power1 (U40.38 U41.38), Power3 (U45.5), Power4 (R303.1 U49.39)
MIO0_QSPI0_SCLK: QSPI_EMMC_MICROSD (U11.6), PS_MIO (U1.AG15)
MIO1_QSPI0_IO1: QSPI_EMMC_MICROSD (U11.2), PS_MIO (U1.AG16)
MIO2_QSPI0_IO2: QSPI_EMMC_MICROSD (R44.2 U11.3), PS_MIO (U1.AF15)
MIO3_QSPI0_IO3: QSPI_EMMC_MICROSD (R45.2 U11.7), PS_MIO (U1.AH15)
MIO4_QSPI0_IO0: QSPI_EMMC_MICROSD (U11.5), PS_MIO (U1.AH16)
MIO5_QSPI0_SS_B: QSPI_EMMC_MICROSD (R43.2 U11.1), PS_MIO (U1.AD16)
MIO7_QSPI1_SS_B: QSPI_EMMC_MICROSD (R46.2 U12.1), PS_MIO (U1.AH17)
MIO8_QSPI1_IO0: QSPI_EMMC_MICROSD (U12.5), PS_MIO (U1.AF17)
MIO9_QSPI1_IO1: QSPI_EMMC_MICROSD (U12.2), PS_MIO (U1.AC16)
MIO10_QSPI1_IO2: QSPI_EMMC_MICROSD (R47.2 U12.3), PS_MIO (U1.AD17)
MIO11_QSPI1_IO3: QSPI_EMMC_MICROSD (R48.2 U12.7), PS_MIO (U1.AE17)
MIO12_QSPI1_SCLK: QSPI_EMMC_MICROSD (U12.6), PS_MIO (U1.AC17)
MIO13_EMMC0_IO0: QSPI_EMMC_MICROSD (R65.1 SD1.6), PS_MIO (U1.AH18)
MIO14_EMMC0_IO1: QSPI_EMMC_MICROSD (R66.1 SD1.29), PS_MIO (U1.AG18)
MIO15_EMMC0_IO2: QSPI_EMMC_MICROSD (R67.1 SD1.27), PS_MIO (U1.AE18)
MIO16_EMMC0_IO3: QSPI_EMMC_MICROSD (R68.1 SD1.10), PS_MIO (U1.AF18)
MIO17_EMMC0_IO4: QSPI_EMMC_MICROSD (R69.1 SD1.4), PS_MIO (U1.AC18)
MIO18_EMMC0_IO5: QSPI_EMMC_MICROSD (R70.1 SD1.2), PS_MIO (U1.AC19)
MIO19_EMMC0_IO6: QSPI_EMMC_MICROSD (R71.1 SD1.33), PS_MIO (U1.AE19)
MIO20_EMMC0_IO7: QSPI_EMMC_MICROSD (R72.1 SD1.31), PS_MIO (U1.AD19)
MIO21_EMMC0_CMD: QSPI_EMMC_MICROSD (R74.1 SD1.25), PS_MIO (U1.AC21)
MIO22_EMMC0_CLK: QSPI_EMMC_MICROSD (R75.1), PS_MIO (U1.AB20)
MIO23_INT_N: QSPI_EMMC_MICROSD (U15.13), PS_MIO (U1.AB18)
MIO24_I2C1_SCL: QSPI_EMMC_MICROSD (R49.1 U13.6 U14.12 U15.14), PS_MIO (U1.AB19)
MIO25_I2C1_SDA: QSPI_EMMC_MICROSD (R50.1 U13.5 U14.13 U15.15), PS_MIO (U1.AB21)
MIO52_USB0_CLK: PS_MIO (U1.G18), USB3.0_UART (U17.1)
MIO53_USB0_DIR: PS_MIO (U1.D16), USB3.0_UART (U17.31)
MIO54_USB0_D2: PS_MIO (U1.F17), USB3.0_UART (U17.5)
MIO55_USB0_NXT: PS_MIO (U1.B16), USB3.0_UART (U17.2)
MIO56_USB0_D0: PS_MIO (U1.C16), USB3.0_UART (U17.3)
MIO57_USB0_D1: PS_MIO (U1.A16), USB3.0_UART (U17.4)
MIO58_USB0_STP: PS_MIO (U1.F18), USB3.0_UART (U17.29)
MIO59_USB0_D3: PS_MIO (U1.E17), USB3.0_UART (U17.6)
MIO60_USB0_D4: PS_MIO (U1.C17), USB3.0_UART (U17.7)
MIO61_USB0_D5: PS_MIO (U1.D17), USB3.0_UART (U17.9)
MIO62_USB0_D6: PS_MIO (U1.A17), USB3.0_UART (U17.10)
MIO63_USB0_D7: PS_MIO (U1.E18), USB3.0_UART (U17.13)
MIO64_GEM3_TX_CLK: PS_MIO (U1.E19), ETH-PHY (R226.1)
MIO65_GEM3_TX_D0: PS_MIO (U1.A18), ETH-PHY (R231.1)
MIO66_GEM3_TX_D1: PS_MIO (U1.G19), ETH-PHY (R230.1)
MIO67_GEM3_TX_D2: PS_MIO (U1.B18), ETH-PHY (R229.1)
MIO68_GEM3_TX_D3: PS_MIO (U1.C18), ETH-PHY (R228.1)
MIO69_GEM3_TX_CTL: PS_MIO (U1.D19), ETH-PHY (R227.1)
MIO70_GEM3_RX_CLK: PS_MIO (U1.C19), ETH-PHY (U39.32)
MIO71_GEM3_RX_D0: PS_MIO (U1.B19), ETH-PHY (R211.1 R212.1 U39.33)
MIO72_GEM3_RX_D1: PS_MIO (U1.G20), ETH-PHY (U39.34)
MIO73_GEM3_RX_D2: PS_MIO (U1.G21), ETH-PHY (R214.1 R216.1 U39.35)
MIO74_GEM3_RX_D3: PS_MIO (U1.D20), ETH-PHY (U39.36)
MIO75_GEM3_RX_CTL: PS_MIO (U1.A19), ETH-PHY (R233.2 R234.2 U39.38)
MIO76_GEM3_MDC: PS_MIO (U1.B20), ETH-PHY (U39.16)
MIO77_GEM3_MDIO: PS_MIO (U1.F20), ETH-PHY (R236.2 U39.17)
P1_TXRXA_N: Eth_Switch (U31.2), Eth_Switch_RJ45 (J16.10)
P1_TXRXA_P: Eth_Switch (U31.1), Eth_Switch_RJ45 (J16.11)
P1_TXRXB_N: Eth_Switch (U31.5), Eth_Switch_RJ45 (J16.5)
P1_TXRXB_P: Eth_Switch (U31.4), Eth_Switch_RJ45 (J16.4)
P1_TXRXC_N: Eth_Switch (U31.7), Eth_Switch_RJ45 (J16.2)
P1_TXRXC_P: Eth_Switch (U31.6), Eth_Switch_RJ45 (J16.3)
P1_TXRXD_N: Eth_Switch (U31.9), Eth_Switch_RJ45 (J16.9)
P1_TXRXD_P: Eth_Switch (U31.8), Eth_Switch_RJ45 (J16.8)
P1_USB0_RST_N: QSPI_EMMC_MICROSD (U15.5), USB3.0_UART (R88.1 U22.1)
P2_GEM3_RST_N: QSPI_EMMC_MICROSD (U15.6), ETH-PHY (R210.1 U37.1)
P2_TXRXA_N: Eth_Switch (U31.13), Eth_Switch_RJ45 (J17.10)
P2_TXRXA_P: Eth_Switch (U31.12), Eth_Switch_RJ45 (J17.11)
P2_TXRXB_N: Eth_Switch (U31.16), Eth_Switch_RJ45 (J17.5)
P2_TXRXB_P: Eth_Switch (U31.15), Eth_Switch_RJ45 (J17.4)
P2_TXRXC_N: Eth_Switch (U31.18), Eth_Switch_RJ45 (J17.2)
P2_TXRXC_P: Eth_Switch (U31.17), Eth_Switch_RJ45 (J17.3)
P2_TXRXD_N: Eth_Switch (U31.21), Eth_Switch_RJ45 (J17.9)
P2_TXRXD_P: Eth_Switch (U31.20), Eth_Switch_RJ45 (J17.8)
P3_GEM3_PWDN_N: QSPI_EMMC_MICROSD (U15.7), ETH-PHY (R242.1 U39.44)
P3_TXRXA_N: Eth_Switch (U31.25), Eth_Switch_RJ45 (J19.10)
P3_TXRXA_P: Eth_Switch (U31.24), Eth_Switch_RJ45 (J19.11)
P3_TXRXB_N: Eth_Switch (U31.27), Eth_Switch_RJ45 (J19.5)
P3_TXRXB_P: Eth_Switch (U31.26), Eth_Switch_RJ45 (J19.4)
P3_TXRXC_N: Eth_Switch (U31.29), Eth_Switch_RJ45 (J19.2)
P3_TXRXC_P: Eth_Switch (U31.28), Eth_Switch_RJ45 (J19.3)
P3_TXRXD_N: Eth_Switch (U31.32), Eth_Switch_RJ45 (J19.9)
P3_TXRXD_P: Eth_Switch (U31.31), Eth_Switch_RJ45 (J19.8)
P4_TXRXA_N: Eth_Switch (U31.35), Eth_Switch_RJ45 (J15.10)
P4_TXRXA_P: Eth_Switch (U31.34), Eth_Switch_RJ45 (J15.11)
P4_TXRXB_N: Eth_Switch (U31.38), Eth_Switch_RJ45 (J15.5)
P4_TXRXB_P: Eth_Switch (U31.37), Eth_Switch_RJ45 (J15.4)
P4_TXRXC_N: Eth_Switch (U31.40), Eth_Switch_RJ45 (J15.2)
P4_TXRXC_P: Eth_Switch (U31.39), Eth_Switch_RJ45 (J15.3)
P4_TXRXD_N: Eth_Switch (U31.43), Eth_Switch_RJ45 (J15.9)
P4_TXRXD_P: Eth_Switch (U31.42), Eth_Switch_RJ45 (J15.8)
P5_TXRXA_N: Eth_Switch (U31.113), Eth_Switch_RJ45 (J18.10)
P5_TXRXA_P: Eth_Switch (U31.112), Eth_Switch_RJ45 (J18.11)
P5_TXRXB_N: Eth_Switch (U31.116), Eth_Switch_RJ45 (J18.5)
P5_TXRXB_P: Eth_Switch (U31.115), Eth_Switch_RJ45 (J18.4)
P5_TXRXC_N: Eth_Switch (U31.118), Eth_Switch_RJ45 (J18.2)
P5_TXRXC_P: Eth_Switch (U31.117), Eth_Switch_RJ45 (J18.3)
P5_TXRXD_N: Eth_Switch (U31.121), Eth_Switch_RJ45 (J18.9)
P5_TXRXD_P: Eth_Switch (U31.120), Eth_Switch_RJ45 (J18.8)
PL_SYSCLK_N: PS_GTR (U50.12), PL_IO (R1.2 U1.AF12)
PL_SYSCLK_P: PS_GTR (U50.11), PL_IO (R1.1 U1.AE12)
PME_N: PL_IO (U1.B14), Eth_Switch (R162.2 U31.93)
PORT_EXPANDER_SCL: PL_IO (U1.A15), PMOD_ARD_RASP (R91.1 U24.22 U25.22)
PORT_EXPANDER_SDA: PL_IO (U1.B15), PMOD_ARD_RASP (R90.1 U24.23 U25.23)
RESET_B: QSPI_EMMC_MICROSD (U16.2), JTAG (U7.4), USB3.0_UART (U22.2), Eth_Switch (U33.2), ETH-PHY (U37.2)
SD_CD: QSPI_EMMC_MICROSD (R58.2 R62.1), PS_MIO (U1.K20)
SD_CLK: QSPI_EMMC_MICROSD (R57.1), PS_MIO (R319.2)
SD_CLK_R: QSPI_EMMC_MICROSD (B1.5 R57.2), PS_MIO (R319.1 U1.L21)
SD_CMD: QSPI_EMMC_MICROSD (B1.3 R55.1), PS_MIO (R318.2)
SD_D0: QSPI_EMMC_MICROSD (B1.7), PS_MIO (R314.2)
SD_D1: QSPI_EMMC_MICROSD (B1.8), PS_MIO (R315.2)
SD_D2: QSPI_EMMC_MICROSD (B1.1), PS_MIO (R316.2)
SD_D3: QSPI_EMMC_MICROSD (B1.2), PS_MIO (R317.2)
SD_WP: QSPI_EMMC_MICROSD (R63.2 R64.2), PS_MIO (U1.J20)
SERIRQ: PL_IO (U1.E15), eMMC_TPM (U30.16)
SUSCLK: PL_IO (U1.F15), eMMC_TPM (U30.20)
SYNCLKO_ZYNQ: PL_IO (U1.B13), Eth_Switch (R181.2 R182.2)
USB_UART_RXD: PS_MIO (U1.H18), USB3.0_UART (U18.21)
USB_UART_TXD: PS_MIO (U1.H19), USB3.0_UART (U18.20)
VCC_INT_PGOOD: Power2 (R279.1 U43.39), Power3 (U46.38)
VCCO_PSIO_PGOOD: Power3 (R293.1 U46.39 U47.5), Power4 (U49.38)
WL_SDIO_CLK: PL_IO (U1.AA11), WIFI_BT (R185.1 U34.8)
WL_SDIO_CMD: PL_IO (U1.AA10), WIFI_BT (R186.1 U34.6)
WL_SDIO_D0: PL_IO (U1.AC11), WIFI_BT (R187.1 U34.10)
WL_SDIO_D1: PL_IO (U1.AB11), WIFI_BT (R188.1 U34.11)
WL_SDIO_D2: PL_IO (U1.AD10), WIFI_BT (R189.1 U34.12)
WL_SDIO_D3: PL_IO (U1.AD11), WIFI_BT (R190.1 U34.13)
WLAN_EN_SOC: PL_IO (U1.AB9), WIFI_BT (R183.2 U34.40)
WLAN_IRQ: PL_IO (U1.AD12), WIFI_BT (R191.1 U34.14)